# Altium schematic sheet EsquematicoCaneca.SchDoc
size 381 x 241 mm; SheetNumber: 1; SheetTotal: 1; SPICEModelCacheUOUFJJBP: <root> / <DocumentId>UOUFJJBP</DocumentId> / </root>
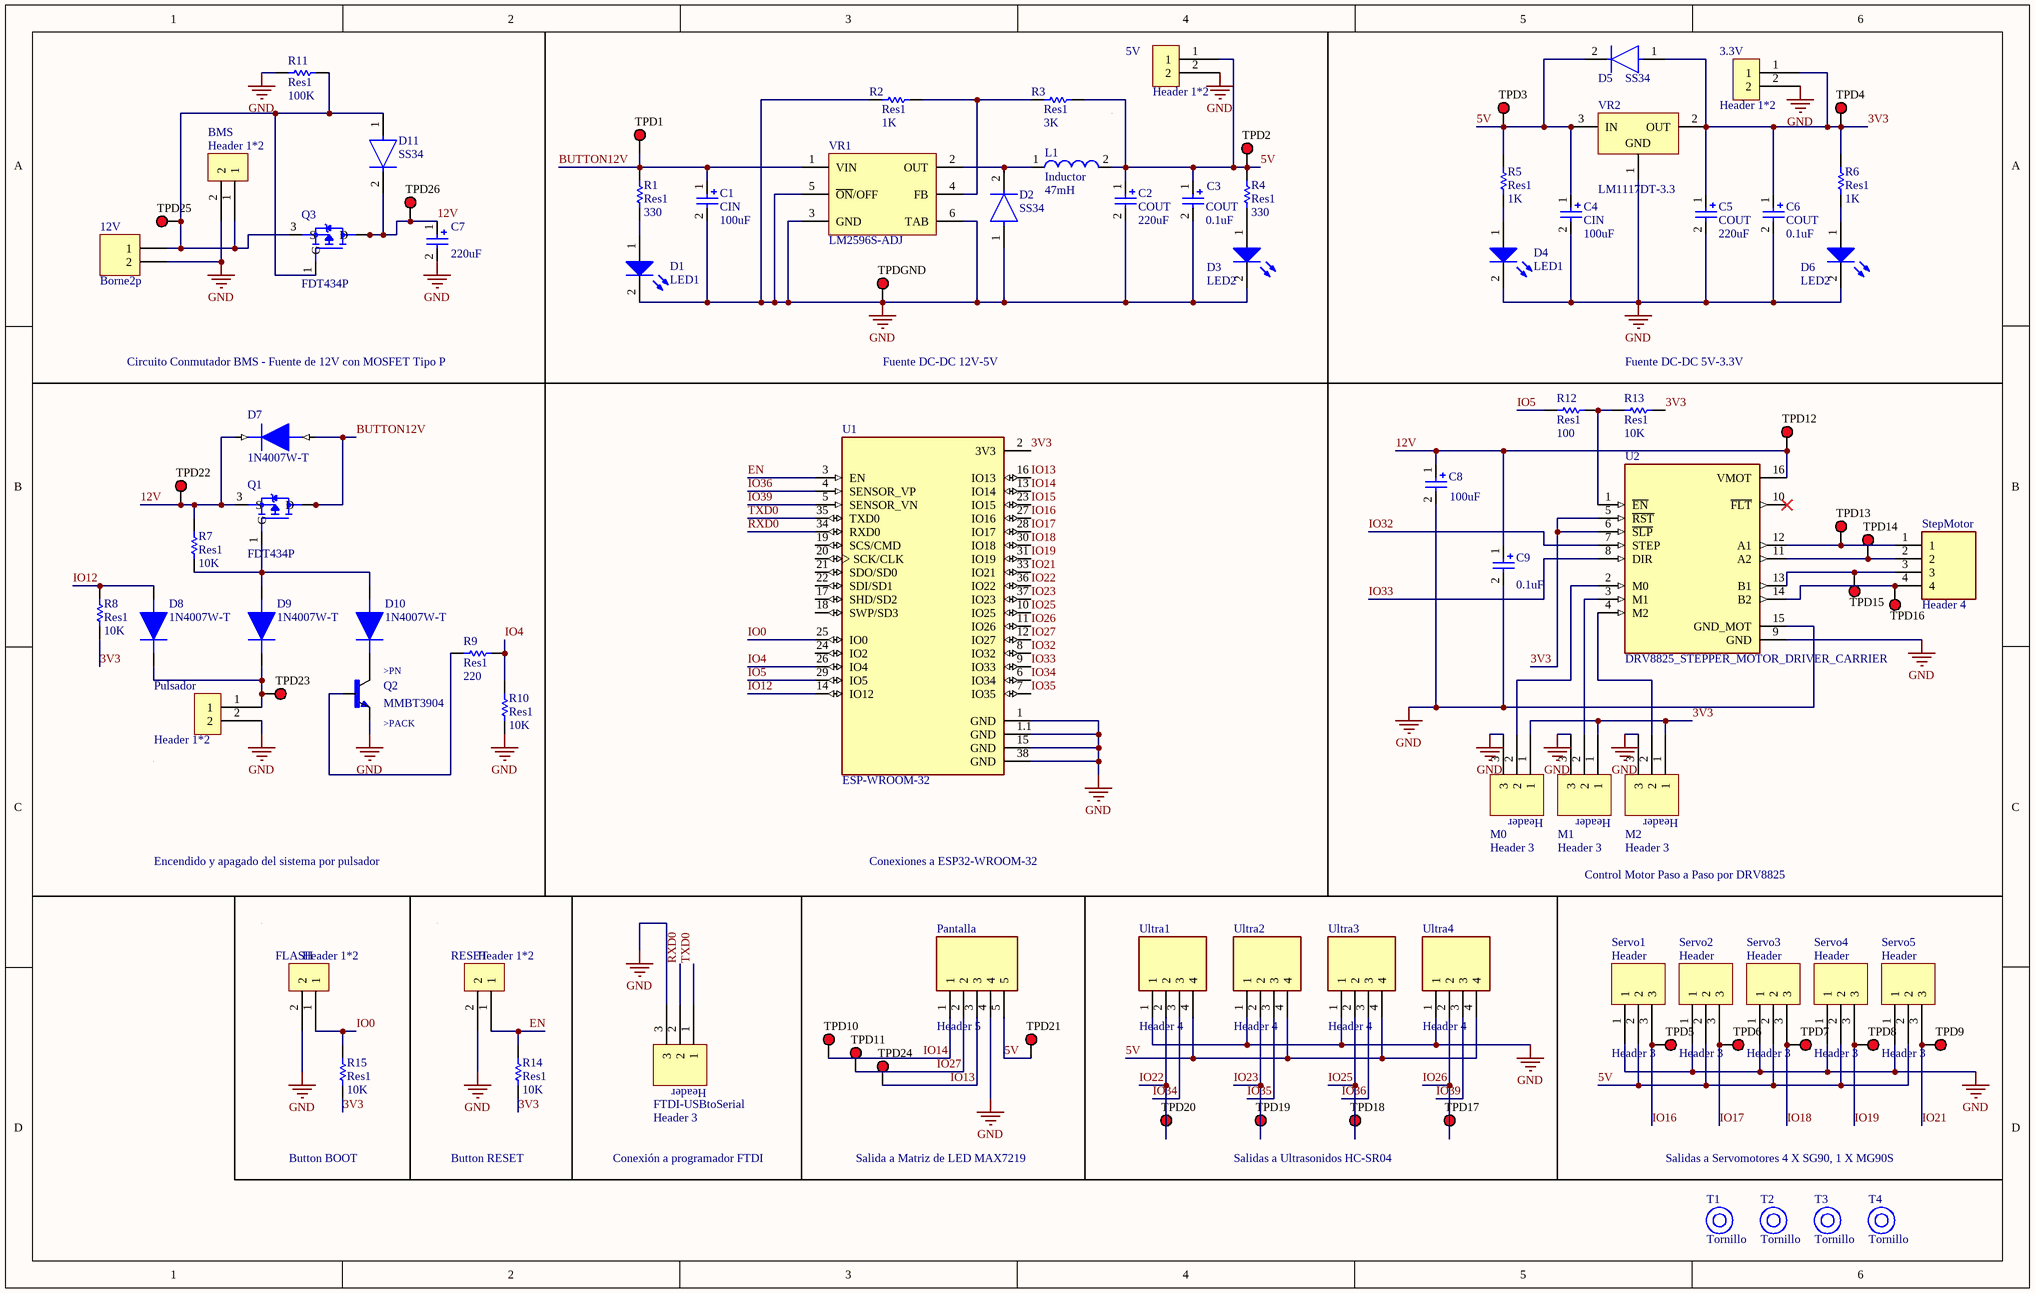
[diagram p0: EsquematicoCaneca.SchDoc]

## Parts
3.3V  Header 1*2  [Header 1X2]
5V  Header 1*2  [Header 1X2]
12V  Borne2p  [Terminal block 1x2 izq]
BMS  Header 1*2  [Header 1X2]
C1  CIN  value 100uF  [CAPACITOR ALUMINUM]
C2  COUT  value 220uF  [CAPACITOR ALUMINUM]
C3  COUT  value 0.1uF  [CC1206]
C4  CIN  value 100uF  [CAPACITOR ALUMINUM]
C5  COUT  value 220uF  [CAPACITOR ALUMINUM]
C6  COUT  value 0.1uF  [CC1206]
C7  value 220uF  [CAPACITOR ALUMINUM]
C8  value 100uF  [CAPACITOR ALUMINUM]
C9  value 0.1uF  [CC1206]
D1  LED1  [LED 0805]
D2  SS34  [SS34 DIODE]
D3  LED2  [LED 0805]
D4  LED1  [LED 0805]
D5  SS34  [SS34 DIODE]
D6  LED2  [LED 0805]
D7  1N4007W-T  [SODFL3818X130N]
D8  1N4007W-T  [SODFL3818X130N]
D9  1N4007W-T  [SODFL3818X130N]
D10  1N4007W-T  [SODFL3818X130N]
D11  SS34  [SS34 DIODE]
FLASH  Header 1*2  [Header 1X2]
FTDI-USBtoSerial  Header 3  [header 1x3]
L1  Inductor  value 47mH  [INDUCTOR]
M0  Header 3  [header 1x3]
M1  Header 3  [header 1x3]
M2  Header 3  [header 1x3]
Pantalla  Header 5  [HEADER X 5]
Pulsador  Header 1*2  [Header 1X2]
Q1  FDT434P  [SOT230P700X180-4N]
Q2  MMBT3904  [MMBT3904]
Q3  FDT434P  [SOT230P700X180-4N]
R1  Res1  value 330  [RESISTOR 1206]
R2  Res1  value 1K  [RESISTOR 1206]
R3  Res1  value 3K  [RESISTOR 1206]
R4  Res1  value 330  [RESISTOR 1206]
R5  Res1  value 1K  [RESISTOR 1206]
R6  Res1  value 1K  [RESISTOR 1206]
R7  Res1  value 10K  [RESISTOR 1206]
R8  Res1  value 10K  [RESISTOR 1206]
R9  Res1  value 220  [RESISTOR 1206]
R10  Res1  value 10K  [RESISTOR 1206]
R11  Res1  value 100K  [RESISTOR 1206]
R12  Res1  value 100  [RESISTOR 1206]
R13  Res1  value 10K  [RESISTOR 1206]
R14  Res1  value 10K  [RESISTOR 1206]
R15  Res1  value 10K  [RESISTOR 1206]
RESET  Header 1*2  [Header 1X2]
Servo1  Header 3  [header 1x3]
Servo2  Header 3  [header 1x3]
Servo3  Header 3  [header 1x3]
Servo4  Header 3  [header 1x3]
Servo5  Header 3  [header 1x3]
StepMotor  Header 4  [HEADER 1X4]
T1  Tornillo  [TORNILLO]
T2  Tornillo  [TORNILLO]
T3  Tornillo  [TORNILLO]
T4  Tornillo  [TORNILLO]
TPD1  (no value)  [TESTPOINT SMT]
TPD2  (no value)  [TESTPOINT SMT]
TPD3  (no value)  [TESTPOINT SMT]
TPD4  (no value)  [TESTPOINT SMT]
TPD5  (no value)  [TESTPOINT SMT]
TPD6  (no value)  [TESTPOINT SMT]
TPD7  (no value)  [TESTPOINT SMT]
TPD8  (no value)  [TESTPOINT SMT]
TPD9  (no value)  [TESTPOINT SMT]
TPD10  (no value)  [TESTPOINT SMT]
TPD11  (no value)  [TESTPOINT SMT]
TPD12  (no value)  [TESTPOINT SMT]
TPD13  (no value)  [TESTPOINT SMT]
TPD14  (no value)  [TESTPOINT SMT]
TPD15  (no value)  [TESTPOINT SMT]
TPD16  (no value)  [TESTPOINT SMT]
TPD17  (no value)  [TESTPOINT SMT]
TPD18  (no value)  [TESTPOINT SMT]
TPD19  (no value)  [TESTPOINT SMT]
TPD20  (no value)  [TESTPOINT SMT]
TPD21  (no value)  [TESTPOINT SMT]
TPD22  (no value)  [TESTPOINT SMT]
TPD23  (no value)  [TESTPOINT SMT]
TPD24  (no value)  [TESTPOINT SMT]
TPD25  (no value)  [TESTPOINT SMT]
TPD26  (no value)  [TESTPOINT SMT]
TPDGND  (no value)  [TESTPOINT SMT]
U1  ESP-WROOM-32  [MODULE_ESP-WROOM-32]
U2  DRV8825_STEPPER_MOTOR_DRIVER_CARRIER  [IC_DRV8825_STEPPER_MOTOR_DRIVER_CARRIER]
Ultra1  Header 4  [HEADER 1X4]
Ultra2  Header 4  [HEADER 1X4]
Ultra3  Header 4  [HEADER 1X4]
Ultra4  Header 4  [HEADER 1X4]
VR1  LM2596S-ADJ  [lm2596S]
VR2  LM1117DT-3.3  [LM1117DT-3.3]

## Nets
GND: 3.3V.2 5V.2 12V.2 BMS.2 C1.2 C2.2 C3.2 C4.2 C5.2 C6.2 C7.2 C8.2 C9.2 D1.2(K) D2.1(A) D3.2(K) D4.2(K) D6.2(K) FLASH.2 FTDI-USBtoSerial.3 M0.3 M1.3 M2.3 Pantalla.4 Pulsador.2 Q2.2(E) R2.1 R10.1 R11.2 RESET.2 Servo1.1 Servo2.1 Servo3.1 Servo4.1 Servo5.1 TPDGND.1 U1.1(GND) U1.1.1(GND) U1.15(GND) U1.38(GND) U2.9(GND) U2.15(GND_MOT) Ultra1.1 Ultra2.1 Ultra3.1 Ultra4.1 VR1.3(GND) VR1.5(~{ON}/OFF) VR1.6(TAB) VR2.1(GND)
3V3: 3.3V.1 C5.1 C6.1 D5.1(A) M0.1 M1.1 M2.1 R6.2 R8.1 R13.1 R14.1 R15.1 TPD4.1 U1.2(3V3) U2.5(~{RST}) U2.6(~{SLP}) VR2.2(OUT)
5V: 5V.1 C2.1 C3.1 C4.1 D5.2(C) L1.2 Pantalla.5 R3.2 R4.2 R5.2 Servo1.2 Servo2.2 Servo3.2 Servo4.2 Servo5.2 TPD2.1 TPD3.1 TPD21.1 Ultra1.4 Ultra2.4 Ultra3.4 Ultra4.4 VR2.3(IN)
12V: C7.1 C8.1 C9.1 D7.1(K) D11.2(C) Q1.3(S) Q3.2(D) Q3.4(D) R7.2 TPD12.1 TPD22.1 TPD26.1 U2.16(VMOT)
BUTTON12V: C1.1 D7.2(A) Q1.2(D) Q1.4(D) R1.2 TPD1.1 VR1.1(VIN)
EN: R14.2 RESET.1 U1.3(EN)
IO0: FLASH.1 R15.2 U1.25(IO0)
IO4: R9.2 R10.2 U1.26(IO4)
IO5: R12.1 U1.29(IO5)
IO12: D8.2(A) R8.2 U1.14(IO12)
IO13: Pantalla.3 TPD24.1 U1.16(IO13)
IO14: Pantalla.1 TPD10.1 U1.13(IO14)
IO15: U1.23(IO15)
IO16: Servo1.3 TPD5.1 U1.27(IO16)
IO17: Servo2.3 TPD6.1 U1.28(IO17)
IO18: Servo3.3 TPD7.1 U1.30(IO18)
IO19: Servo4.3 TPD8.1 U1.31(IO19)
IO21: Servo5.3 TPD9.1 U1.33(IO21)
IO22: TPD20.1 U1.36(IO22) Ultra1.2
IO23: TPD19.1 U1.37(IO23) Ultra2.2
IO25: TPD18.1 U1.10(IO25) Ultra3.2
IO26: TPD17.1 U1.11(IO26) Ultra4.2
IO27: Pantalla.2 TPD11.1 U1.12(IO27)
IO32: U1.8(IO32) U2.7(STEP)
IO33: U1.9(IO33) U2.8(DIR)
IO34: U1.6(IO34) Ultra1.3
IO35: U1.7(IO35) Ultra2.3
IO36: U1.4(SENSOR_VP) Ultra3.3
IO39: U1.5(SENSOR_VN) Ultra4.3
RXD0: FTDI-USBtoSerial.2 U1.34(RXD0)
TXD0: FTDI-USBtoSerial.1 U1.35(TXD0)
Net12V_1: 12V.1 BMS.1 D11.1(A) Q3.1(G) Q3.3(S) R11.1 TPD25.1
NetD1_1: D1.1(A) R1.1
NetD2_2: D2.2(C) L1.1 VR1.2(OUT)
NetD3_1: D3.1(A) R4.1
NetD4_1: D4.1(A) R5.1
NetD6_1: D6.1(A) R6.1
NetD8_1: D8.1(K) D9.1(K) Pulsador.1 TPD23.1
NetD9_2: D9.2(A) D10.2(A) Q1.1(G) R7.1
NetD10_1: D10.1(K) Q2.3(C)
NetM0_2: M0.2 U2.2(M0)
NetM1_2: M1.2 U2.3(M1)
NetM2_2: M2.2 U2.4(M2)
NetQ2_1: Q2.1(B) R9.1
NetR2_2: R2.2 R3.1 VR1.4(FB)
NetR12_2: R12.2 R13.2 U2.1(~{EN})
NetStepMotor_1: StepMotor.1 TPD13.1 U2.12(A1)
NetStepMotor_2: StepMotor.2 TPD14.1 U2.11(A2)
NetStepMotor_3: StepMotor.3 TPD15.1 U2.13(B1)
NetStepMotor_4: StepMotor.4 TPD16.1 U2.14(B2)

Not connected (* = marked no-connect by the designer): U1 17(SHD/SD2) 18(SWP/SD3) 19(SCS/CMD) 20(SCK/CLK) 21(SDO/SD0) 22(SDI/SD1) 24(IO2); U2 10(~{FLT})*

## Notes on the sheet
- Circuito Conmutador BMS - Fuente de 12V con MOSFET Tipo P
- Fuente DC-DC 12V-5V
- Fuente DC-DC 5V-3.3V
- Encendido y apagado del sistema por pulsador
- Conexiones a ESP32-WROOM-32
- Control Motor Paso a Paso por DRV8825
- Button BOOT
- Button RESET
- Conexión a programador FTDI
- Salida a Matriz de LED MAX7219
- Salidas a Ultrasonidos HC-SR04
- Salidas a Servomotores 4 X SG90, 1 X MG90S
- (in symbol Header 3) Header
- (in symbol MMBT3904) >PN; >PACK

## Library data of the parts
12V = Header 2: Header, 2-Pin; LatestRevisionDate: 17-Jul-2002; LatestRevisionNote: Re-released for DXP Platform.; Publisher: Altium Limited
C1 C4 C8 = Cap Pol1: Polarized Capacitor (Radial); Published: 8-Jun-2000; LatestRevisionDate: 17-Jul-2002; LatestRevisionNote: Re-released for DXP Platform.; PackageReference: RB7.6-15; Publisher: Altium Limited; PackageDescription: Polarized Capacitor (Radial); 2 Leads
C2 C5 C7 = Cap Pol1_1: Polarized Capacitor (Radial); Published: 8-Jun-2000; LatestRevisionDate: 17-Jul-2002; LatestRevisionNote: Re-released for DXP Platform.; PackageReference: RB7.6-15; Publisher: Altium Limited; PackageDescription: Polarized Capacitor (Radial); 2 Leads
C3 C6 C9 = Cap Pol1_2: Polarized Capacitor (Radial); Published: 8-Jun-2000; LatestRevisionDate: 17-Jul-2002; LatestRevisionNote: Re-released for DXP Platform.; PackageReference: RB7.6-15; Publisher: Altium Limited; PackageDescription: Polarized Capacitor (Radial); 2 Leads
D1 = LED0_1: Typical INFRARED GaAs LED; Published: 8-Jun-2000; LatestRevisionDate: 08-Jul-2005; LatestRevisionNote: Mech Layer 1 removed.; PackageReference: LED-0; Publisher: Altium Limited; PackageDescription: LED; 2 Leads
D2 D5 D11 = CMP-02539-000012-1: DIODE SCHOTTKY 40V 3A DO214AB; Manufacturer: Vishay; Manufacturer Part Number: SS34-E3/57T; Max Junction Temp: +150°C; Peak Reverse Current: 0.5mA; Max Surge Forward Current: 100A; Standoff Height: 0mm; ComponentLink2Description: Datasheet; Device Class L3: Schottky Diodes; Height: 2.62mm; Max Repetitive Reverse Voltage: 40V; Lead Free: Yes; Package: 95402; Temperature Range High: +150°C; ComponentLink2URL: http://www.vishay.com/docs/88751/ss32.pdf; Temperature: -55°C to +150°C; Footprint Url: http://www.vishay.com/docs/95402/smc.pdf; Automotive: No; Forward Current: 3A; Category: Diode; RoHS: TRUE; Device Class L2: Diodes; Mouser Description: Schottky Diodes & Rectifiers 3.0 Amp 40 Volt; Octopart: https://octopart.com/ss34-e3%2F57t-vishay-39552907; Temperature Range Low: -55°C; Device Class L1: Discrete Semiconductors; Digikey Description: DIODE SCHOTTKY 40V 3A DO214AB
D3 D4 D6 = LED0: Typical INFRARED GaAs LED; Published: 8-Jun-2000; LatestRevisionDate: 08-Jul-2005; LatestRevisionNote: Mech Layer 1 removed.; PackageReference: LED-0; Publisher: Altium Limited; PackageDescription: LED; 2 Leads
D7-D10 = 1N4007W-T: STANDARD SOD123FL T/R 3000; MF: EIC; SnapEDA_Link: https://www.snapeda.com/parts/1N4007W/EIC+Semiconductor/view-part/?ref=snap; Package: DO-214AA-214 EIC; Value: *; MP: 1N4007W; Check_prices: https://www.snapeda.com/parts/1N4007W/EIC+Semiconductor/view-part/?ref=eda
L1 = Inductor: Code_IEC: 1005; Published: 8-Jun-2000; LatestRevisionDate: 29-May-2009; LatestRevisionNote: IPC-7351 Footprint Added.; PackageReference: 0402-A; Publisher: Altium Limited; PackageDescription: Chip Inductor; Code_JEITA: 0402
Pantalla = Header 5: Board-To-Board Connector, Through Hole, Header, 5, 2.54 mm, Gold Plated Contacts; MF: TE Connectivity; MP: 826646-5; SnapEDA_Link: https://www.snapeda.com/parts/826646-5/TE+Connectivity+AMP+Connectors/view-part/?ref=snap; Package: None; Value: *; EU_RoHS_Compliance: Compliant; Check_prices: https://www.snapeda.com/parts/826646-5/TE+Connectivity+AMP+Connectors/view-part/?ref=eda
Q1 Q3 = FDT434P: P-Channel 20 V 6A (Ta) 3W (Ta) Surface Mount SOT-223-4; MF: ON; SnapEDA_Link: https://www.snapeda.com/parts/FDT434P/Onsemi/view-part/?ref=snap; Package: SOT-223-4 Fairchild Semiconductor; Value: *; MP: FDT434P; Check_prices: https://www.snapeda.com/parts/FDT434P/Onsemi/view-part/?ref=eda
R1 R4 = Res1_2: Resistor; Published: 8-Jun-2000; LatestRevisionDate: 17-Jul-2002; LatestRevisionNote: Re-released for DXP Platform.; PackageReference: AXIAL-0.3; Publisher: Altium Limited; PackageDescription: Axial Device, Thru-Hole; 2 Leads; 0.3 in Pin Spacing
R2 R5-R15 = Res1: Resistor; Published: 8-Jun-2000; LatestRevisionDate: 17-Jul-2002; LatestRevisionNote: Re-released for DXP Platform.; PackageReference: AXIAL-0.3; Publisher: Altium Limited; PackageDescription: Axial Device, Thru-Hole; 2 Leads; 0.3 in Pin Spacing
R3 = Res1_1: Resistor; Published: 8-Jun-2000; LatestRevisionDate: 17-Jul-2002; LatestRevisionNote: Re-released for DXP Platform.; PackageReference: AXIAL-0.3; Publisher: Altium Limited; PackageDescription: Axial Device, Thru-Hole; 2 Leads; 0.3 in Pin Spacing
StepMotor Ultra1-Ultra4 = Header 4: MP: 640453-4; MF: {'manufacturer': 'TE Connectivity'}; Price: None; Package: None; Availability: Unavailable; Value: *
TPD1-TPD26 TPDGND = TestPointRed: Test Point, Red, Through Hole, RoHS, Bulk; Manufacturer: Keystone; Contact Material: Bronze; Mounting Technology: Through Hole; RoHSCompliant: true; Pins: 1; Package Quantity: 100; ComponentLink2Description: Datasheet; Height: 8.12 mm; ComponentLink1URL: http://www.keyelco.com/; DatasheetVersion: Rev. F, 12/2013; Mount: Through Hole; PackageReference: 5010; Contact Plating: Silver; Packaging: Bulk; Colour: Red; REACH SVHC: No SVHC; PackageDescription: 1-Pin Through Hole Device, Dia 3.17 mm; ComponentLink2URL: http://www.keyelco.com/product-pdf.cfm?p=1319; ComponentLink1Description: Manufacturer URL
U1 = ESP-WROOM-32: Transceptor serie ESP-WROOM-32; Placa de evaluaciÃ³n 802.11 b/g/n (Wi-Fi, WiFi, WLAN), BluetoothÂ® Smart 4.x de bajo consumo (BLE); MF: Espressif Systems; SnapEDA_Link: https://www.snapeda.com/parts/ESP-WROOM-32/Espressif+Systems/view-part/?ref=snap; Package: Module Espressif Systems; Value: *; MP: ESP-WROOM-32; Check_prices: https://www.snapeda.com/parts/ESP-WROOM-32/Espressif+Systems/view-part/?ref=eda
U2 = DRV8825_STEPPER_MOTOR_DRIVER_CARRIER: Stepper motor controler; IC: DRV8825; 1.5A; Uin mot: 8.2Ã·45V; Availability: Unavailable; MP: DRV8825_STEPPER_MOTOR_DRIVER_CARRIER; Value: *; Price: None; Package: None
VR1 = LM2596S-ADJ: SIMPLE SWITCHER® Power Converter 150 KHz 3A Step-Down Voltage Regulator, 5-pin TO-263; Manufacturer: National Semiconductor; Manufacturer: TI National Semiconductor; Manufacturer Part Number: LM2596SADJ; PackageTopMarking: NSUZXYTTE#*LM2596S*-ADJ P+; PowerWise: N; ComponentLink1Description: LM2596 Datasheet; RoHS: N; PackageVersion: revD, Apr-2005; DatasheetVersion: May-2002; ComponentLink2Description: LM2596 Web Page; ComponentLink2URL: http://www.national.com/pf/LM/LM2596.html; RevisionNote: Component URLs added; PackageDescription: TO-263, Molded, .400 x .390 x .180in, 5 Lead, .067in Pitch, Surface Mount; ComponentLink3Description: TS5B Package Page; ComponentLink1URL: http://www.national.com/ds/LM/LM2596.pdf; PackageReference: TS5B; Code_JEDEC: MO-169-AB; PinCount: 5; ComponentLink3URL: http://www.national.com/packaging/folders/ts5b.html; CompType: Switcher
VR2 = LM1117DT-3.3: 800mA Low-Dropout Linear Regulator, 3-pin TO-252; Manufacturer: National Semiconductor; Manufacturer: TI National Semiconductor; CompType: LDO IC; PowerWise: N; PackageTopMarking: NSUZXYTT*LM1117*DT-3.3; RevisionNote: Component URLs added; ComponentLink1URL: http://www.national.com/ds/LM/LM1117.pdf; ComponentLink2URL: http://www.national.com/pf/LM/LM1117.html; ComponentLink2Description: LM1117 Web Page; ComponentLink3URL: http://www.national.com/packaging/folders/td03b.html; DatasheetVersion: Apr-2006; PackageDescription: TO252, Molded, Jedec, 6.8 x 6.10 x 2.30mm Body, 3 Lead, 2.28mm Pitch, Surface Mount; Code_JEDEC: TO-252-AA; PackageReference: TD03B; RoHS: N; ComponentLink3Description: TD03B Package Page; ComponentLink1Description: LM1117 Datasheet; PackageVersion: revD, Feb-2009; PinCount: 3; Manufacturer Part Number: LM1117DT-3.3
Q2 = MMBT3904: SnapEDA_Link: https://www.snapeda.com/parts/MMBT3904/STMicroelectronics/view-part/?ref=snap; Check_prices: https://www.snapeda.com/parts/MMBT3904/STMicroelectronics/view-part/?ref=eda; Value: *